# Altium project Farag_32U4_v2.1.PrjPcb
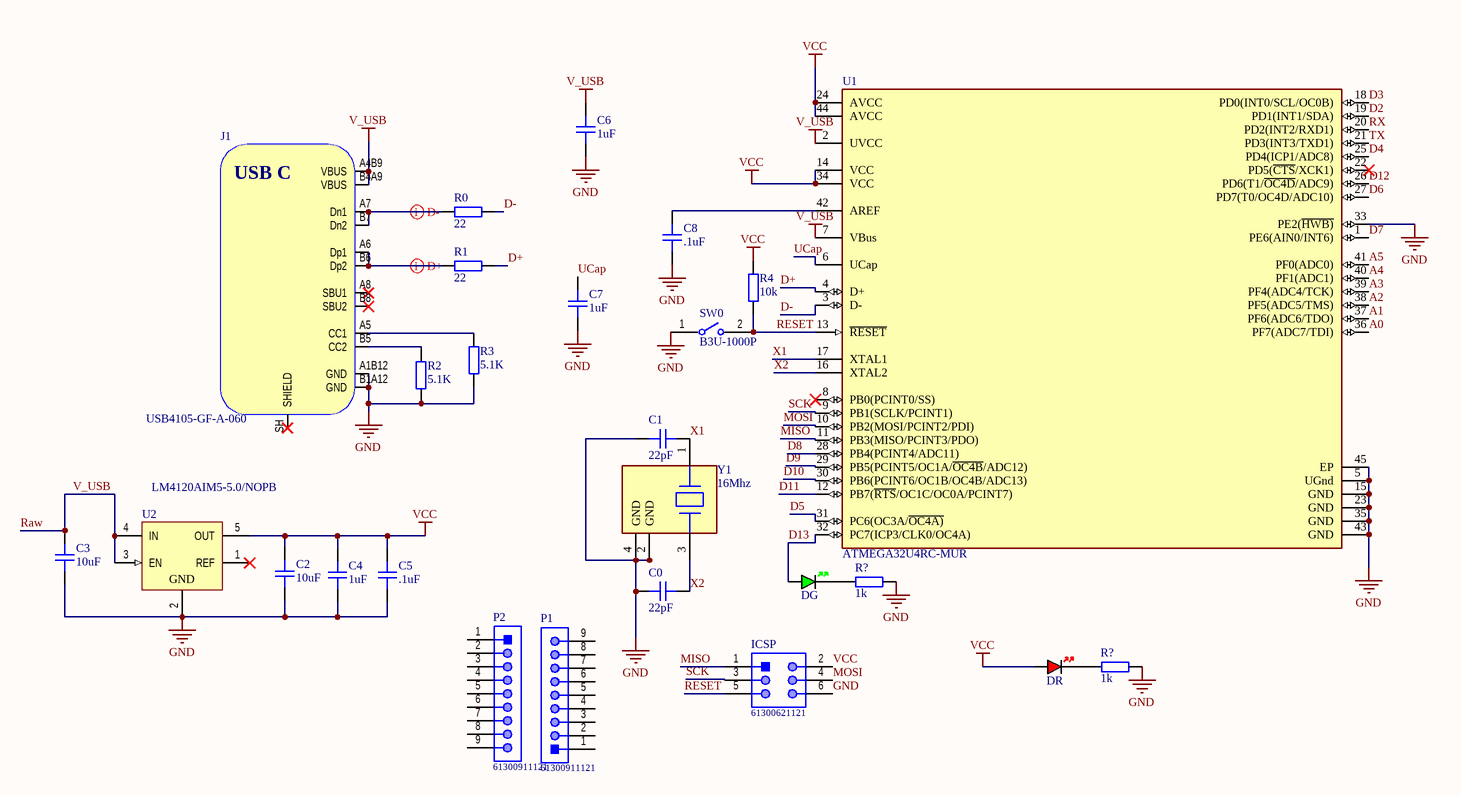
[diagram p0: Sheet1.SchDoc]
CAGE_CODE: ?????; CONTRACT_NUMBER: <CONTRACT NO>; DOC_NO_ASSY_DWG: <ASSY DWG NO>; DOC_NO_BOM: <BOM DOC NO>; DOC_NO_FAB_DWG: <FAB DWG NO>; DOC_NO_SCH_DWG: <SCH DWG NO>; PCB_2_DEC_TOL: +/-.01; PCB_3_DEC_TOL: +/-.010; PCB_ANG_TOL: +/-1/2; PCB_ASSEMBLY_NO: <PCB ASSY NO>; PCB_CHECKER: - -----; PCB_CHECKER_APP_DATE: --/--/----; PCB_DESIGNER: - -----; PCB_DESIGNER_APP_DATE: --/--/----; PCB_DWG_NO: <PCB DWG NO>; PCB_ENGINEER: - -----; PCB_ENGINEER_APP_DATE: --/--/----; PCB_PART_NUMBER: <PCB PN>; PCB_REV: A; SCH_REV: A
1 sheet, 26 parts. Net scope: global (net labels, ports and power ports of the same name join across sheets).
Board file: PCB2.PcbDoc

## Sheet Sheet1.SchDoc
size 431 x 279 mm; SheetNumber: 1; SheetTotal: 1; ENG_APP_DATE: --/--/--; DSN_APP_DATE: --/--/--; CHK_APP_DATE: --/--/--

### Parts
(Parts that share a designator on the sheet are numbered #1, #2 ... from top to bottom, then left to right.)
C0  22pF  [CAP_0402]
C1  22pF  [CAP_0402]
C2  10uF  [CAP_0805]
C3  10uF  [CAP_0805]
C4  1uF  [CAP_0402]
C5  .1uF  [CAP_0402]
C6  1uF  [CAP_0402]
C7  1uF  [CAP_0402]
C8  .1uF  [CAP_0402]
DG  GREEN  [LED_0603_GREEN]  (value not drawn)
DR  RED  [LED_0603_RED]  (value not drawn)
ICSP  61300621121  [61300621121]
J1  USB4105-GF-A-060  [USB4105-GF-A-060]
P1  61300911121  [61300911121]
P2  61300911121  [61300911121]
R0  22  [RES_0402]
R1  22  [RES_0402]
R2  5.1K  [RES_0402]
R3  5.1K  [RES_0402]
R4  10k  [RES_0402]
R?#1  1k  [RES_0402]
R?#2  1k  [RES_0402]
SW0  B3U-1000P  [FP-B3U-1000P-MFG]
U1  ATMEGA32U4RC-MUR  [FP-44PW-IPC_A]
U2  LM4120AIM5-5.0/NOPB  [MF05A_M]
Y1  16Mhz  [FP-ABM8G-MFG]

### Nets
GND: C0.1 C1.1 C2.2 C3.2 C4.2 C5.2 C6.2 C7.2 C8.2 ICSP.6 J1.A1B12(GND) J1.B1A12(GND) R2.2 R3.2 R?#1.1 R?#2.1 SW0.1 U1.5(UGnd) U1.15(GND) U1.23(GND) U1.33(PE2(~{HWB)}) U1.35(GND) U1.43(GND) U1.45(EP) U2.2(GND) Y1.2(GND) Y1.4(GND)
Raw: C3.1 C6.1 J1.A4B9(VBUS) J1.B4A9(VBUS) U1.2(UVCC) U1.7(VBus) U2.3(EN) U2.4(IN)  [also labelled V_USB]
VCC: C2.1 C4.1 C5.1 DR.A ICSP.2 R4.1 U1.14(VCC) U1.24(AVCC) U1.34(VCC) U1.44(AVCC) U2.5(OUT)
A0: U1.36(PF7(ADC7/TDI))
A1: U1.37(PF6(ADC6/TDO))
A2: U1.38(PF5(ADC5/TMS))
A3: U1.39(PF4(ADC4/TCK))
A4: U1.40(PF1(ADC1))
A5: U1.41(PF0(ADC0))
D2: U1.19(PD1(INT1/SDA))
D3: U1.18(PD0(INT0/SCL/OC0B))
D4: U1.25(PD4(ICP1/ADC8))
D5: U1.31(PC6(OC3A/~{OC4A)})
D6: U1.27(PD7(T0/OC4D/ADC10))
D7: U1.1(PE6(AIN0/INT6))
D8: U1.28(PB4(PCINT4/ADC11))
D9: U1.29(PB5(PCINT5/OC1A/~{OC4B}/ADC12))
D10: U1.30(PB6(PCINT6/OC1B/OC4B/ADC13))
D11: U1.12(PB7(~{RTS}/OC1C/OC0A/PCINT7))
D12: U1.26(PD6(T1/~{OC4D}/ADC9))
D13: DG.A U1.32(PC7(ICP3/CLK0/OC4A))
D+: R1.2 U1.4(D+)
D-: R0.2 U1.3(D-)
MISO: ICSP.1 U1.11(PB3(MISO/PCINT3/PDO))
MOSI: ICSP.4 U1.10(PB2(MOSI/PCINT2/PDI))
RESET: ICSP.5 R4.2 SW0.2 U1.13(~{RESET})
RX: U1.20(PD2(INT2/RXD1))
SCK: ICSP.3 U1.9(PB1(SCLK/PCINT1))
TX: U1.21(PD3(INT3/TXD1))
UCap: C7.1 U1.6(UCap)
X1: C1.2 U1.17(XTAL1) Y1.1
X2: C0.2 U1.16(XTAL2) Y1.3
NetC8_1: C8.1 U1.42(AREF)
NetDG_K: DG.K R?#1.2
NetDR_K: DR.K R?#2.2
NetJ1_A5: J1.A5(CC1) R3.1
NetJ1_A6: J1.A6(Dp1) J1.B6(Dp2) R1.1
NetJ1_A7: J1.A7(Dn1) J1.B7(Dn2) R0.1
NetJ1_B5: J1.B5(CC2) R2.1

Not connected (* = marked no-connect by the designer): J1 A8(SBU1)* B8(SBU2)* SH(SHIELD)*; P1 1 2 3 4 5 6 7 8 9; P2 1 2 3 4 5 6 7 8 9; U1 8(PB0(PCINT0/SS))* 22(PD5(~{CTS}/XCK1))*; U2 1(REF)*

### Layout directives
differential pair; differential pair class Usb_D: NetJ1_A6, NetJ1_A7

### Notes on the sheet
- 8
- 7
- 6
- 5
- 4
- 3
- DWG. NO.
- REV.
- SHT.
- 2
- 1
- THIS DOCUMENT AND THE DATA DISCLOSED HEREIN OR HEREWITH IS THE PROPERTY OF ALTIUM LIMITED AND MAY BE FREELY DISTRIBUTED IN WHOLE. NO RIGHTS ARE RESERVED OR EXPRESS OR IMPLIED WARANTEE GIVEN.
- REVISION
- DESCRIPTION
- DATE
- APPROVED
- F
- E
- D
- C
- B
- ENG:
- APPROVALS
- PROJECT
- SUITE 200
- 2175 SALK AVENUE
- CARLSBAD, CA 92008
- A
- DSN:
- CHK:
- REFERENCE DOCUMENTS
- PROJECT REVISION:
- TITLE
- DOCUMENT REVISION:
- DESIGN ITEM:
- USA
- BOM:
- FAB DWG:
- PCB DWG:
- ASSY DWG:
- SCALE:
- SIZE
- CAGE CODE
- FILE NAME
- DWG NO.
- SHEET
- OF
- REV
- (in symbol USB4105-GF-A-060) USB C

### Library data of the parts
C0 C1 = CAP_0402_10V: Capacitor SMD 0402 10V
C2 C3 = CAP_0805_16V: Capacitor SMD 0805 16V
C4-C8 = CAP_0402_6V3: Capacitor SMD 0402 6V3
DG = LED_0603_GREEN: LED 0603 GREEN SMD
DR = LED_0603_RED: LED 0603 RED SMD
ICSP = CMP-1502-01072-1: THT Vertical Pin Header WR-PHD, Pitch 2.54 mm, Dual Row, 6 pins; Manufacturer: Wurth Elektronik; Contact Resistance: 20mOhm; Withstanding Voltage: 500VAC; Pin Number: 6; Gender: Male; Pitch: 2.54mm; Working Voltage: 250VAC; Rated Current: 3A; Packaging: Bag; Row Number: Dual; Manufacturer URL: http://www.we-online.de; Part Number: 61300621121; Operating Temperature: -40to105degC; Mounting Technology: THT; Package Reference: 61300621121; Datasheet URL: https://katalog.we-online.de/em/datasheet/6130xx21121.pdf; Orientation: Vertical; Publisher: WurthElektronik
J1 = USB4105-GF-A-060: USB Connector Type C SMT 12 Pin; Manufacturer: GCT; Manufacturer Part Number: USB4105-GF-A-060
P1 P2 = CMP-1502-01080-1: THT Vertical Pin Header WR-PHD, Pitch 2.54 mm, Single Row, 9 pins; Manufacturer: Wurth Elektronik; Pitch: 2.54mm; Gender: Male; Working Voltage: 250VAC; Contact Resistance: 20mOhm; Withstanding Voltage: 500VAC; Pin Number: 9; Rated Current: 3A; Package Reference: 61300911121; Part Number: 61300911121; Mounting Technology: THT; Publisher: WurthElektronik; Manufacturer URL: http://www.we-online.de; Orientation: Vertical; Datasheet URL: https://katalog.we-online.de/em/datasheet/6130xx11121.pdf; Operating Temperature: -40to105degC; Row Number: Single; Packaging: Bag
R0-R4 R?#1 R?#2 = RES_0402: Resistor SMD 0402; Manufacturer: *; Manufacturer Part Number: *; Distributor Link: *
SW0 = CMP-2100-03586-2: SWITCH TACTILE SPST-NO 0.05A 12V; Contact Resistance: 100mR; Operating Force: 1.5N; Max Current Rating: 50mA; Switch Travel: 0.15mm; Actuator Type: Standard; Mechanical Life: 200000Cycles; Ratings: Dust Proof; Illumination Type: Non-Illuminated; Throw Configuration: SPST; Actuator Length: 0.4mm; Switch Function: Off-Mom; Height: 1.2mm; Width: 3mm; Weight: 0.000776oz; Contact Material: Silver; Max Voltage Rating (DC): 12V; Insulation Resistance: 100MR; Lead Free: Lead Free; Current Rating: 50mA; Termination: SMD/SMT; Length: 4mm; Voltage Rating (DC): 12V; Contact Current Rating: 50mA; Orientation: Straight; Depth: 2.5mm; Max Operating Temperature: 70°C; Packaging: Tape and Reel; Min Operating Temperature: -25°C; Package Quantity: 1; Mount: Surface Mount; Electrical Life: 200000Cycles
U1 = CMP-06276-000241-1: IC MCU 8BIT 32KB FLASH 44VQFN; Core Architecture: AVR; Frequency: 16MHz; Oscillator Type: Internal; Interface: I2C; Peripherals: Brown-out Detect/Reset; Number of I/Os: 26; Packaging: Tape and Reel; Max Operating Temperature: 85°C; Min Operating Temperature: -40°C; Memory Type: FLASH; Case/Package: VQFN; Memory Size: 32KB; RoHS Compliant: Yes
U2 = CMP-0074-00179-2: Precision Micropower Low Dropout Voltage Reference, 5-pin SOT-23, Pb-Free; Manufacturer: National Semiconductor; CompType: Voltage Reference IC; PowerWise: Y; PackageTopMarking: R18A*XTT; RoHS: Y; ComponentLink3URL: http://www.national.com/packaging/folders/mf05a.html; ComponentLink2Description: LM4120 Web Page; ComponentLink1Description: LM4120 Datasheet; DatasheetVersion: Mar-2005; ComponentLink3Description: MF05A Package Page; PinCount: 5; PackageVersion: revD, Aug-2008; PackageDescription: Molded SOT-23, .115 x .063 x .040 in Body, 5 Lead, .0375 in Pitch; ComponentLink2URL: http://www.national.com/pf/LM/LM4120.html; PackageReference: MF05A; RevisionNote: Component URLs added; ComponentLink1URL: http://www.national.com/ds/LM/LM4120.pdf
Y1 = CMP-27762-006537-2: Crystal 16MHz ±20ppm (Tol) ±30ppm (Stability) 18pF FUND 80Ω 4-Pin SMD T/R; Series Resistance: 80R; Radiation Hardening: No; Load Capacitance: 18pF; Package Quantity: 1000; Frequency Stability: 30ppm; ESR (Equivalent Series Resistance): 80R; Depth: 2.5mm; Height: 1mm; Number of Pins: 4; Frequency Tolerance: 20ppm; Frequency: 16MHz; Tolerance: 20ppm; Min Operating Temperature: -40°C; Length: 3.2mm; Termination: SMD/SMT; Max Operating Temperature: 85°C; Width: 2.5mm; Series: ABM8G; Mount: Surface Mount; Case/Package: CSMD; Lead Free: Lead Free; Operating Frequency: 16 MHz; Packaging: Tape and Reel